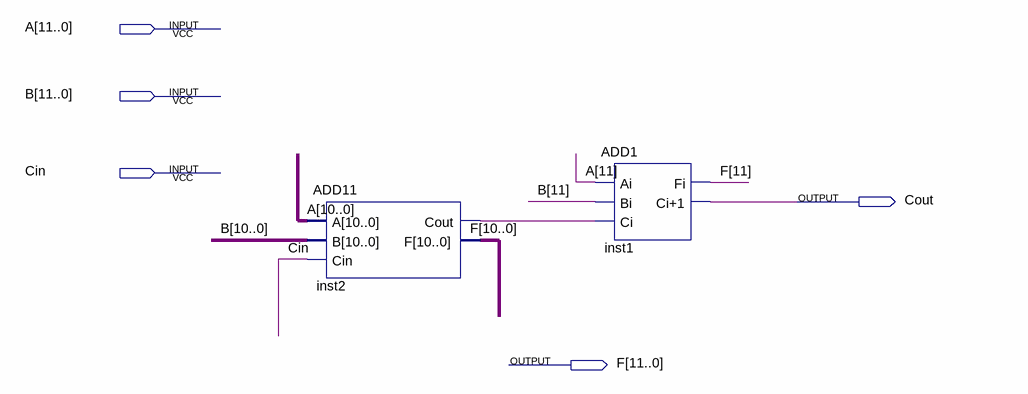
[diagram p0: schematic sheet]
// Quartus schematic ADD12.bdf as structural Verilog: 2 symbols, 5 pins
module ADD12 (
  input  [11:0] A,
  input  [11:0] B,
  input  Cin,
  output Cout,
  output [11:0] F
);

  wire inst2_cout;

  ADD11 inst2 (.A(A[10:0]), .B(B[10:0]), .Cin(Cin), .Cout(inst2_cout), .F(F[10:0]));
  ADD1 inst1 (.Ai(A[11]), .Bi(B[11]), .Ci(inst2_cout), .Fi(F[11]), .\Ci+1 (Cout));
endmodule
